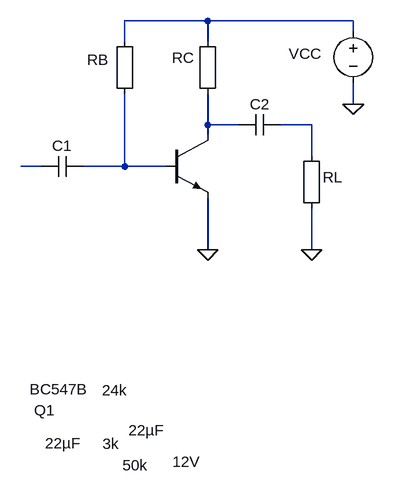
[diagram p0: schematic BT-CE-AMP-FIG.asc]
BT-CE-AMP-FIG.asc, the LTspice schematic file:
Version 4
SHEET 1 880 680
WIRE 192 -64 64 -64
WIRE 416 -64 192 -64
WIRE 416 -48 416 -64
WIRE 64 -32 64 -64
WIRE 192 -32 192 -64
WIRE 416 64 416 32
WIRE 192 96 192 48
WIRE 240 96 192 96
WIRE 352 96 304 96
WIRE 192 112 192 96
WIRE 352 144 352 96
WIRE -64 160 -96 160
WIRE 64 160 64 48
WIRE 64 160 0 160
WIRE 128 160 64 160
WIRE 192 288 192 208
WIRE 352 288 352 224
FLAG 192 288 0
FLAG 416 64 0
FLAG 352 288 0
SYMBOL npn 128 112 R0
WINDOW 0 -203 423 Left 2
WINDOW 3 -210 391 Left 2
SYMATTR InstName Q1
SYMATTR Value BC547B
SYMBOL Misc\\EuropeanResistor 48 -48 R0
WINDOW 0 -42 44 Left 2
WINDOW 3 -19 552 Left 2
SYMATTR InstName RB
SYMATTR Value 24k
SYMBOL Misc\\EuropeanResistor 176 -48 R0
WINDOW 0 -39 41 Left 2
WINDOW 3 -146 635 Left 2
SYMATTR InstName RC
SYMATTR Value 3k
SYMBOL voltage 416 -64 R0
WINDOW 0 -99 51 Left 2
WINDOW 3 -278 678 Left 2
WINDOW 123 0 0 Left 2
WINDOW 39 0 0 Left 2
SYMATTR InstName VCC
SYMATTR Value 12V
SYMBOL cap 0 144 R90
WINDOW 0 0 32 VBottom 2
WINDOW 3 426 31 VTop 2
SYMATTR InstName C1
SYMATTR Value 22µF
SYMBOL cap 304 80 R90
WINDOW 0 0 32 VBottom 2
WINDOW 3 470 206 VTop 2
SYMATTR InstName C2
SYMATTR Value 22µF
SYMBOL Misc\\EuropeanResistor 336 128 R0
WINDOW 0 33 49 Left 2
WINDOW 3 -275 492 Left 2
SYMATTR InstName RL
SYMATTR Value 50k

The netlist it stands for:
* BT-CE-AMP-FIG.asc
Q1 N002 N005 0 0 BC547B
RB N001 N005 24k
RC N001 N002 3k
VCC N001 0 12V
C1 N005 N004 22µF
C2 N003 N002 22µF
RL N003 0 50k
.model NPN NPN
.model PNP PNP
.lib standard.bjt
.backanno
.end